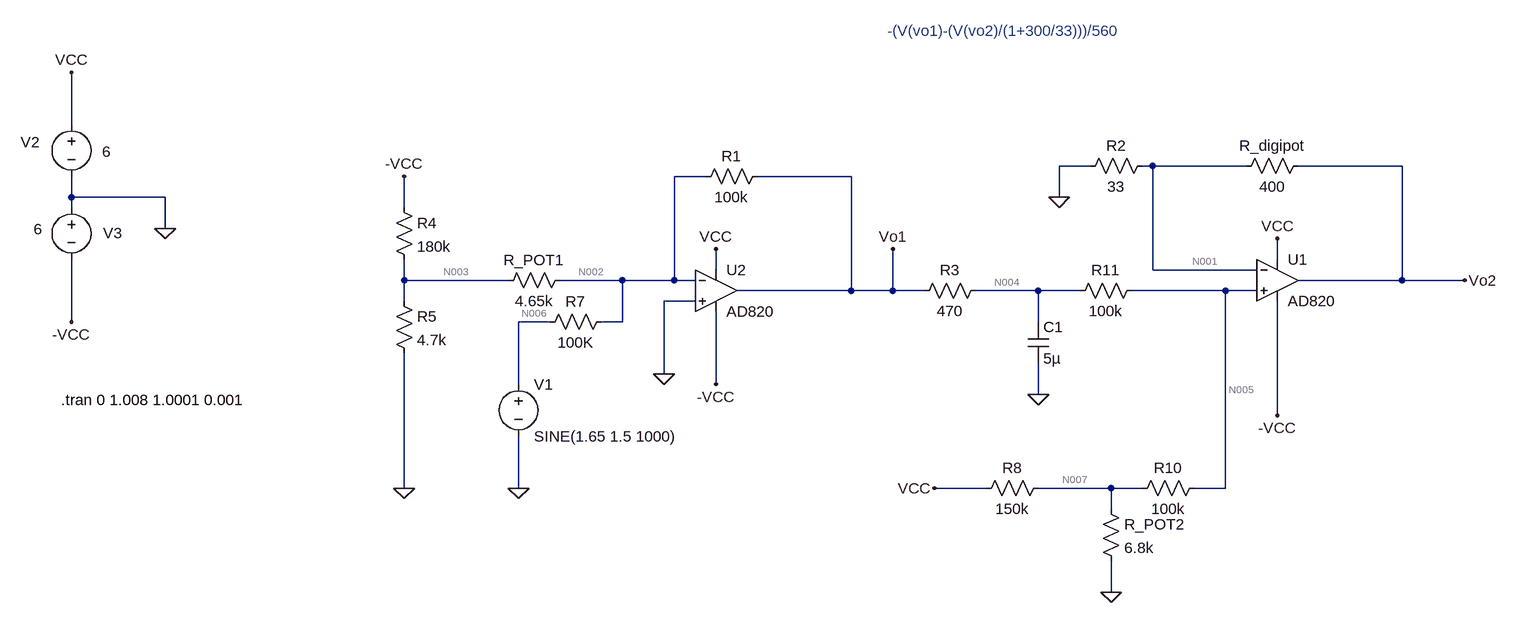
[diagram p0: schematic signal output RailToRail V2.asc]
signal output RailToRail V2.asc, the LTspice schematic file:
Version 4
SHEET 1 1692 772
WIRE -512 -128 -512 -208
WIRE 1056 -64 1008 -64
WIRE 1152 -64 1136 -64
WIRE 1296 -64 1152 -64
WIRE 1536 -64 1376 -64
WIRE 464 -48 416 -48
WIRE 688 -48 544 -48
WIRE -512 -16 -512 -48
WIRE -368 -16 -512 -16
WIRE 1008 -16 1008 -64
WIRE -512 0 -512 -16
WIRE 0 0 0 -48
WIRE -368 32 -368 -16
WIRE 1344 80 1344 48
WIRE 480 96 480 64
WIRE 1152 96 1152 -64
WIRE 1312 96 1152 96
WIRE 0 112 0 80
WIRE 160 112 0 112
WIRE 336 112 240 112
WIRE 416 112 416 -48
WIRE 416 112 336 112
WIRE 448 112 416 112
WIRE 1536 112 1536 -64
WIRE 1536 112 1376 112
WIRE 1632 112 1536 112
WIRE 688 128 688 -48
WIRE 688 128 512 128
WIRE 752 128 752 64
WIRE 752 128 688 128
WIRE 800 128 752 128
WIRE 976 128 880 128
WIRE 1040 128 976 128
WIRE 1264 128 1120 128
WIRE 1312 128 1264 128
WIRE 0 144 0 112
WIRE 448 144 400 144
WIRE -512 176 -512 80
WIRE 224 176 176 176
WIRE 336 176 336 112
WIRE 336 176 304 176
WIRE 976 176 976 128
WIRE 400 256 400 144
WIRE 176 272 176 176
WIRE 480 272 480 160
WIRE 976 288 976 240
WIRE 1344 320 1344 144
WIRE 0 432 0 224
WIRE 176 432 176 352
WIRE 896 432 816 432
WIRE 1088 432 976 432
WIRE 1136 432 1088 432
WIRE 1264 432 1264 128
WIRE 1264 432 1216 432
WIRE 1088 464 1088 432
WIRE 1088 592 1088 544
FLAG 176 432 0
FLAG -512 -208 VCC
FLAG -368 32 0
FLAG 480 64 VCC
FLAG 0 432 0
FLAG 0 -48 -VCC
FLAG 1344 48 VCC
FLAG 480 272 -VCC
FLAG -512 176 -VCC
FLAG 400 256 0
FLAG 976 288 0
FLAG 1008 -16 0
FLAG 752 64 Vo1
FLAG 1632 112 Vo2
FLAG 1088 592 0
FLAG 816 432 VCC
FLAG 1344 320 -VCC
SYMBOL voltage 176 256 R0
WINDOW 123 0 0 Left 0
WINDOW 39 0 0 Left 0
SYMATTR InstName V1
SYMATTR Value SINE(1.65 1.5 1000)
SYMBOL voltage -512 -144 R0
WINDOW 123 0 0 Left 0
WINDOW 39 0 0 Left 0
WINDOW 0 -78 43 Left 2
WINDOW 3 47 58 Left 2
SYMATTR InstName V2
SYMATTR Value 6
SYMBOL res 560 -64 R90
WINDOW 0 0 56 VBottom 2
WINDOW 3 32 56 VTop 2
SYMATTR InstName R1
SYMATTR Value 100k
SYMBOL OpAmps\\AD820 480 64 R0
SYMATTR InstName U2
SYMBOL res -16 -16 R0
SYMATTR InstName R4
SYMATTR Value 180k
SYMBOL res -16 128 R0
SYMATTR InstName R5
SYMATTR Value 4.7k
SYMBOL res 256 96 R90
WINDOW 0 0 56 VBottom 2
WINDOW 3 32 56 VTop 2
SYMATTR InstName R_POT1
SYMATTR Value 4.65k
SYMBOL res 320 160 R90
WINDOW 0 0 56 VBottom 2
WINDOW 3 32 56 VTop 2
SYMATTR InstName R7
SYMATTR Value 100K
SYMBOL OpAmps\\AD820 1344 48 R0
SYMATTR InstName U1
SYMBOL res 1392 -80 R90
WINDOW 0 0 56 VBottom 2
WINDOW 3 32 56 VTop 2
SYMATTR InstName R_digipot
SYMATTR Value 400
SYMBOL voltage -512 -16 R0
WINDOW 123 0 0 Left 0
WINDOW 39 0 0 Left 0
WINDOW 0 49 55 Left 2
WINDOW 3 -58 49 Left 2
SYMATTR InstName V3
SYMATTR Value 6
SYMBOL res 1152 -80 R90
WINDOW 0 0 56 VBottom 2
WINDOW 3 32 56 VTop 2
SYMATTR InstName R2
SYMATTR Value 33
SYMBOL res 896 112 R90
WINDOW 0 0 56 VBottom 2
WINDOW 3 32 56 VTop 2
SYMATTR InstName R3
SYMATTR Value 470
SYMBOL cap 960 176 R0
SYMATTR InstName C1
SYMATTR Value 5µ
SYMBOL res 992 416 R90
WINDOW 0 0 56 VBottom 2
WINDOW 3 32 56 VTop 2
SYMATTR InstName R8
SYMATTR Value 150k
SYMBOL res 1072 448 R0
SYMATTR InstName R_POT2
SYMATTR Value 6.8k
SYMBOL res 1136 112 R90
WINDOW 0 0 56 VBottom 2
WINDOW 3 32 56 VTop 2
SYMATTR InstName R11
SYMATTR Value 100k
SYMBOL res 1232 416 R90
WINDOW 0 0 56 VBottom 2
WINDOW 3 32 56 VTop 2
SYMATTR InstName R10
SYMATTR Value 100k
TEXT -528 296 Left 2 !.tran 0 1.008 1.0001 0.001
TEXT 744 -272 Left 2 ;-(V(vo1)-(V(vo2)/(1+300/33)))/560

The netlist it stands for:
* signal output RailToRail V2.asc
V1 N006 0 SINE(1.65 1.5 1000)
V2 VCC 0 6
R1 Vo1 N002 100k
XU2 0 N002 VCC -VCC Vo1 AD820  ; pins In+ In- V+ V- OUT
R4 -VCC N003 180k
R5 N003 0 4.7k
R_POT1 N002 N003 4.65k
R7 N002 N006 100K
XU1 N005 N001 VCC -VCC Vo2 AD820  ; pins In+ In- V+ V- OUT
R_digipot Vo2 N001 400
V3 0 -VCC 6
R2 N001 0 33
R3 N004 Vo1 470
C1 N004 0 5µ
R8 N007 VCC 150k
R_POT2 N007 0 6.8k
R11 N005 N004 100k
R10 N005 N007 100k
.tran 0 1.008 1.0001 0.001
* -(V(vo1)-(V(vo2)/(1+300/33)))/560
.backanno
.end

* Results of the author's LTspice run, read from the files saved beside the schematic
* Operating Point, zero values left out:
*   V(n006) = 1.65 V
*   V(vcc) = 6 V
*   V(vo1) = 4.1 mV
*   V(n002) = 39.54 nV
*   V(-vcc) = -6 V
*   V(n003) = -76.92 mV
*   V(n001) = 128.4 mV
*   V(n005) = 128.4 mV
*   V(vo2) = 1.685 V
*   V(n004) = 4.682 mV
*   V(n007) = 252.2 mV
*   I(R10) = -1.237 µA
*   I(R11) = 1.237 µA
*   I(R_pot2) = 37.08 µA
*   I(R8) = -38.32 µA
*   I(R3) = 1.237 µA
*   I(R2) = 3.89 mA
*   I(R_digipot) = 3.89 mA
*   I(R7) = -16.5 µA
*   I(R_pot1) = 16.54 µA
*   I(R5) = -16.37 µA
*   I(R4) = -32.91 µA
*   I(R1) = 41 nA
*   I(V3) = -1.441 mA
*   I(V2) = -5.336 mA
*   I(V1) = -16.5 µA
*   Ix(u2:1) = 2 pA
*   Ix(u2:2) = 2 pA
*   Ix(u2:3) = 703 µA
*   Ix(u2:4) = -704.2 µA
*   Ix(u2:5) = 1.196 µA
*   Ix(u1:1) = 2.006 pA
*   Ix(u1:2) = 2.006 pA
*   Ix(u1:3) = 4.594 mA
*   Ix(u1:4) = -703.9 µA
*   Ix(u1:5) = -3.89 mA
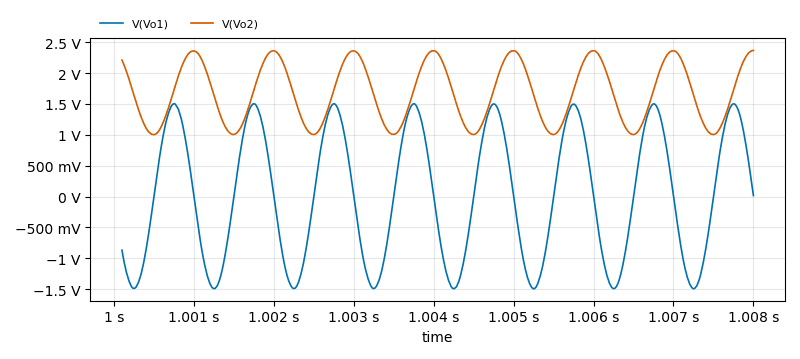
[diagram p1: Transient Analysis of signal output RailToRail V2.asc, plotted from the saved traces]
* Transient Analysis, 1 run:
*   V(Vo1): min -1.494 V, max 1.503 V, average 9.743 mV, rms 1.06 V, last 15.35 mV
*   V(Vo2): min 1.002 V, max 2.367 V, average 1.676 V, rms 1.743 V, last 2.367 V